# Altium schematic sheet PMIC.SchDoc: PMIC
size A4; DrawnBy: ThanhQuoc; Revision: V01; SheetNumber: 4; SheetTotal: 21; Project: RV1126 CAMERA BOARD DESIGN
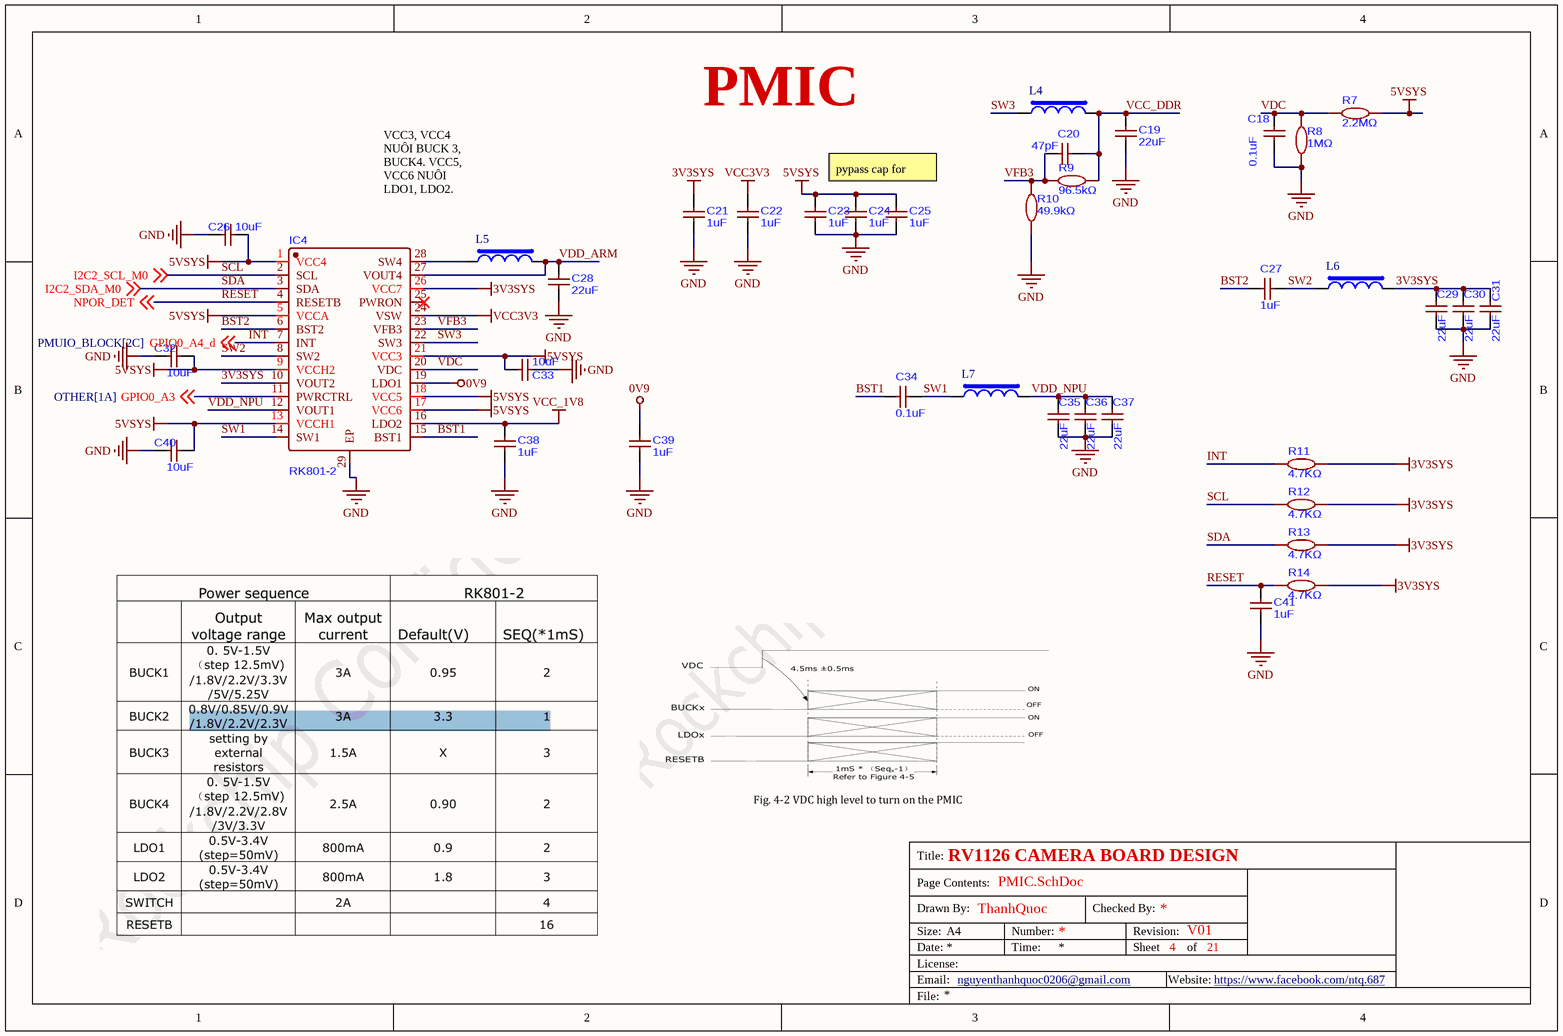
[diagram p0: PMIC.SchDoc]

## Parts
C18  0.1uF  [C0201]
C19  22uF  [C0603]
C20  47pF  [C0201]
C21  1uF  [C0201]
C22  1uF  [C0201]
C23  1uF  [C0201]
C24  1uF  [C0201]
C25  1uF  [C0201]
C26  10uF  [C0402]
C27  1uF  [C0201]
C28  22uF  [C0603]
C29  22uF  [C0402]
C30  22uF  [C0402]
C31  22uF  [C0402]
C32  10uF  [C0402]
C33  10uF  [C0402]
C34  0.1uF  [C0201]
C35  22uF  [C0402]
C36  22uF  [C0402]
C37  22uF  [C0402]
C38  1uF  [C0201]
C39  1uF  [C0201]
C40  10uF  [C0402]
C41  1uF  [C0201]
IC4  RK801-2  [QFN-28_L4.0-W4.0-P0.40-TL-EP2.4]
L4  FTC252012SR47MBCA  [IND_1008]  (value not drawn)
L5  FTC252012SR47MBCA  [IND_1008]  (value not drawn)
L6  PSTMAA252012-2R2MB  [IND_1008]  (value not drawn)
L7  PSTMAA252012-2R2MB  [IND_1008]  (value not drawn)
R7  2.2MΩ  [R0402]
R8  1MΩ  [R0201]
R9  96.5kΩ  [R0402]
R10  49.9kΩ  [R0402]
R11  4.7KΩ  [R0201]
R12  4.7KΩ  [R0201]
R13  4.7KΩ  [R0201]
R14  4.7KΩ  [R0201]

## Nets
0V9: C39.2 IC4.19(LDO1)
3V3SYS: C21.2 C29.2 C30.2 C31.2 IC4.10(VOUT2) IC4.26(VCC7) L6.2 R11.2 R12.2 R13.2 R14.2
5VSYS: C23.2 C24.2 C25.2 C26.2 C32.1 C33.2 C40.2 IC4.1(VCC4) IC4.5(VCCA) IC4.9(VCCH2) IC4.13(VCCH1) IC4.17(VCC6) IC4.18(VCC5) IC4.21(VCC3) R7.2
GND: C18.1 C19.1 C21.1 C22.1 C23.1 C24.1 C25.1 C26.1 C28.1 C29.1 C30.1 C31.1 C32.2 C33.1 C35.1 C36.1 C37.1 C38.1 C39.1 C40.1 C41.1 IC4.29(EP) R8.1 R10.1
VCC3V3: C22.2 IC4.24(VSW)
VCC_1V8: C38.2 IC4.16(LDO2)
BST1: C34.1 IC4.15(BST1)
BST2: C27.2 IC4.6(BST2)
GPIO0_A3: IC4.11(PWRCTRL) ; off-sheet GPIO0_A3
INT: IC4.7(INT) R11.1 ; off-sheet GPIO0_A4_d  [also labelled GPIO0_A4_d]
RESET: C41.2 IC4.4(RESETB) R14.1 ; off-sheet NPOR_DET  [also labelled NPOR_DET]
SCL: IC4.2(SCL) R12.1 ; off-sheet I2C2_SCL_M0  [also labelled I2C2_SCL_M0]
SDA: IC4.3(SDA) R13.1 ; off-sheet I2C2_SDA_M0  [also labelled I2C2_SDA_M0]
SW1: C34.2 IC4.14(SW1) L7.1
SW2: C27.1 IC4.8(SW2) L6.1
SW3: IC4.22(SW3) L4.1
VCC_DDR: C19.2 C20.2 L4.2 R9.2
VDC: C18.2 IC4.20(VDC) R7.1 R8.2
VDD_ARM: C28.2 IC4.27(VOUT4) L5.2
VDD_NPU: C35.2 C36.2 C37.2 IC4.12(VOUT1) L7.2
VFB3: C20.1 IC4.23(VFB3) R9.1 R10.2
NetIC4_28: IC4.28(SW4) L5.1

Not connected (* = marked no-connect by the designer): IC4 25(PWRON)*

## Notes on the sheet
- pypass cap for VCC5, VCC6, VCC7, VCCA
- VCC3, VCC4 NUÔI BUCK 3, BUCK4. VCC5, VCC6 NUÔI LDO1, LDO2. VCC7 NUÔI SW. VCCH1, VCCH2 NUÔI BUCK1, BUCK2
- Title:
- Drawn By:
- Page Contents:
- Checked By:
- Size:
- Date:
- File:
- License:
- Email:
- A4
- nguyenthanhquoc0206@gmail.com
- Number:
- Time:
- Revision:
- Sheet
- Website:
- of
- https://www.facebook.com/ntq.687

## Library data of the parts
C18 C34 = CAP_100nF-16V-10%-0201: CAP CER 100nF 16V X5R 0201
C19 C28 = CAP_22uF-16V-20%-0603: 22uF ±20% 16V Ceramic Capacitor X5R 0603
C20 = CAP_47pF-50V-5%-0201: CAP CER  47pF ±5% 50V C0G 0201
C21-C25 C27 C38 C39 C41 = CAP_1uF-10V-10%-0201: 1uF ±10% 10V Ceramic Capacitor X5R 0201
C26 C32 C33 C40 = CAP_10uF-10V-20%-0402: 10µF ±20% 10V Ceramic Capacitor X5R 0402 (1005 Metric)
C29-C31 C35-C37 = CAP_22uF-10V-20%-0402: 22uF X5R ±20% 10V 0402 Ceramic Capacitors RoHS; ComponentLink1Description: LCSC; ComponentLink1URL: https://www.lcsc.com/product-detail/C385994.html?s_z=n_q_t_22UF&spm=wm.fly.bg.2.xh___wm.ssy.tc.2.tz&lcsc_vid=EwRWBFZSQVIPVFdUTlJfVldeFFRYUFQAElRYBFRRE1MxVlNeRFZbX1BRRVlbVDsOAxUeFF5JWBYZEEoKFBINSQcJGk4NBhADEA4cHktXRlhXSQwSGg0%3D
IC4 = RK801-2: I2C QFN-28-EP(4x4) Power Management - Specialized RoHS
L4 L5 = IND_470nH-6.5A-20%-1008: FIXED IND 0.47uH 6.5A 13mΩ SMD,2x2.5mm; Manufacturer: Murata Electronics; Manufacturer Part Number: DFE252010P-R47M=P2; Case/Package: 1008; Supplier-1: Digikey
L6 L7 = IND_2.2uH-4.1A-20%-1008: 2.2uH Shielded Wirewound Inductor 4.1A 60mOhm Max 1008 (2520 Metric); Manufacturer: Murata Electronics; Manufacturer Part Number: DFE252010-R47M=P2; Case/Package: 1008; Supplier-1: Digikey; ComponentLink1Description: LCSC; ComponentLink1URL: https://www.lcsc.com/product-detail/C45385204.html?s_z=n_q_t_2.2UH&spm=wm.fly.bg.0.xh___wm.ssy.tc.0.tz&lcsc_vid=EwRWBFZSQVIPVFdUTlJfVldeFFRYUFQAElRYBFRRE1MxVlNeRVlWUV1XQ1hZVjsOAxUeFF5JWBYZEEoKFBINSQcJGk4NBhADEA4cHktXRlVcSQwSGg0%3D
R7 = RES_2.2M-62.5W-1%-0402: RES 2.2MΩ ±1% 62.5mW 0402; ComponentLink1Description: LCSC; ComponentLink1URL: https://www.lcsc.com/product-detail/C2998080.html?spm=wm.fly.bg.0.xh&lcsc_vid=EwRWBFZSQVIPVFdUTlJfVldeFFRYUFQAElRYBFRRE1MxVlNeRVlXUFNQQ1RWXjsOAxUeFF5JWBYZEEoKFBINSQcJGk4eFQsCAgIaSgADAwAHC0slRlVYUFFIHxUDCw%3D%3D
R8 = RES_1M-50mW-0.1%-0201: RES 1MΩ ±0.1% 50mW 0201; ComponentLink1Description: LCSC; ComponentLink1URL: https://www.lcsc.com/product-detail/C93949.html?spm=wm.fly.bg.0.xh&lcsc_vid=EwRWBFZSQVIPVFdUTlJfVldeFFRYUFQAElRYBFRRE1MxVlNeRVlXUFNQQ1RWXjsOAxUeFF5JWBYZEEoKFBINSQcJGk4eFQsCAgIaSgADAwAHC0slRlVYUFFIHxUDCw%3D%3D
R9 = RES_96.5K-0.1W-0.1%-0402: RES 96.5kΩ ±0.1% 62.5mW 0402; ComponentLink1Description: LCSC; ComponentLink1URL: https://www.lcsc.com/product-detail/C852962.html?s_z=n_q_t_96.5k&spm=wm.fly.bg.0.xh___wm.ssy.tc.0.tz&lcsc_vid=EwRWBFZSQVIPVFdUTlJfVldeFFRYUFQAElRYBFRRE1MxVlNeRFdZVVBVQ1VfVzsOAxUeFF5JWBYZEEoKFBINSQcJGk4dAgUUFAk%3D
R10 = RES_49.9K-0.1W-0.1%-0402: RES 49.9kΩ ±0.1% 62.5mW 0402; ComponentLink1Description: LCSC; ComponentLink1URL: https://www.lcsc.com/product-detail/C852808.html?spm=wm.fly.bg.1.xh&lcsc_vid=EwRWBFZSQVIPVFdUTlJfVldeFFRYUFQAElRYBFRRE1MxVlNeRFdZVVFWTlNbVTsOAxUeFF5JWBYZEEoKFBINSQcJGk4eFQsCAgIaSgADAwAHC0slT1RcXlJUWQkaCgg%3D
R11-R14 = RES_4.7K-50mW-1%-0201: RES 4.7kΩ ±1% 50mW 0201; ComponentLink1Description: LCSC; ComponentLink1URL: https://www.lcsc.com/product-detail/C295718.html?s_z=n_q_t_120%2520OHM&spm=wm.fly.bg.5.xh___wm.ssy.tc.1.tz&lcsc_vid=EwRWBFZSQVIPVFdUTlJfVldeFFRYUFQAElRYBFRRE1MxVlNeRFZeU1BfTlBYVzsOAxUeFF5JWBYZEEoKFBINSQcJGk4eFQsCAgIaSgADAwAHC0slRVhcV1ZTT08GEwkK